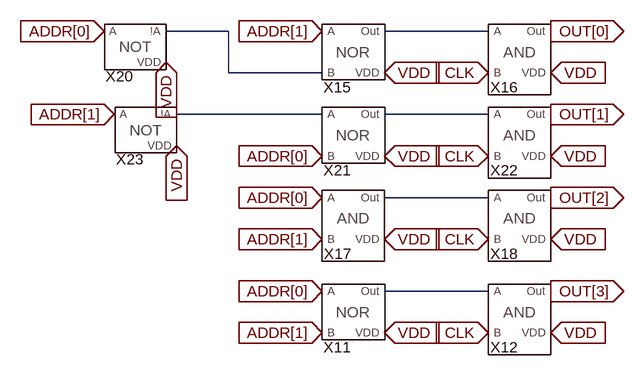
[diagram p0: schematic Decoder.asc]
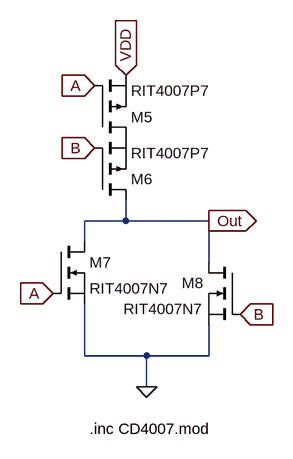
[diagram p1: sub-circuit gate_nor.asc]
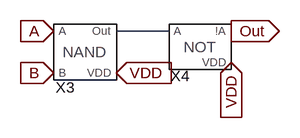
[diagram p2: sub-circuit gate_and.asc]
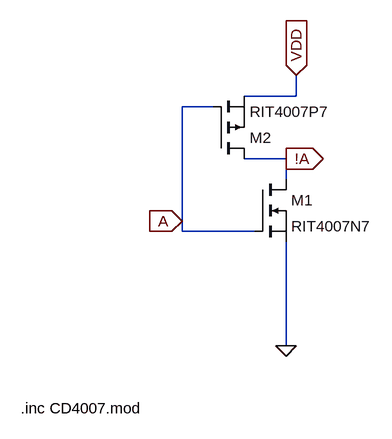
[diagram p3: sub-circuit gate_not.asc]
Decoder.asc, the LTspice schematic file:
Version 4
SHEET 1 1132 1208
WIRE -688 112 -784 112
WIRE -288 112 -448 112
WIRE -688 176 -688 112
WIRE -544 176 -688 176
WIRE -544 240 -768 240
WIRE -288 240 -448 240
WIRE -288 368 -448 368
WIRE -288 512 -448 512
FLAG -544 512 ADDR[0]
IOPIN -544 512 In
FLAG -544 576 ADDR[1]
IOPIN -544 576 In
FLAG -448 576 VDD
IOPIN -448 576 In
FLAG -288 576 CLK
IOPIN -288 576 In
FLAG -192 576 VDD
IOPIN -192 576 In
FLAG -544 112 ADDR[1]
IOPIN -544 112 In
FLAG -880 112 ADDR[0]
IOPIN -880 112 In
FLAG -784 160 VDD
IOPIN -784 160 In
FLAG -288 176 CLK
IOPIN -288 176 In
FLAG -192 176 VDD
IOPIN -192 176 In
FLAG -544 368 ADDR[0]
IOPIN -544 368 In
FLAG -544 432 ADDR[1]
IOPIN -544 432 In
FLAG -448 432 VDD
IOPIN -448 432 In
FLAG -288 432 CLK
IOPIN -288 432 In
FLAG -192 432 VDD
IOPIN -192 432 In
FLAG -864 240 ADDR[1]
IOPIN -864 240 In
FLAG -544 304 ADDR[0]
IOPIN -544 304 In
FLAG -768 288 VDD
IOPIN -768 288 In
FLAG -288 304 CLK
IOPIN -288 304 In
FLAG -192 304 VDD
IOPIN -192 304 In
FLAG -448 304 VDD
IOPIN -448 304 In
FLAG -448 176 VDD
IOPIN -448 176 In
FLAG -192 512 OUT[3]
IOPIN -192 512 Out
FLAG -192 112 OUT[0]
IOPIN -192 112 Out
FLAG -192 240 OUT[1]
IOPIN -192 240 Out
FLAG -192 368 OUT[2]
IOPIN -192 368 Out
SYMBOL Gate_NOR -496 544 R0
SYMATTR InstName X11
SYMBOL Gate_AND -240 544 R0
SYMATTR InstName X12
SYMBOL Gate_NOR -496 144 R0
SYMATTR InstName X15
SYMBOL Gate_AND -240 144 R0
SYMATTR InstName X16
SYMBOL Gate_AND -240 400 R0
SYMATTR InstName X18
SYMBOL Gate_AND -496 400 R0
SYMATTR InstName X17
SYMBOL Gate_NOT -832 144 R0
SYMATTR InstName X20
SYMBOL Gate_NOR -496 272 R0
SYMATTR InstName X21
SYMBOL Gate_AND -240 272 R0
SYMATTR InstName X22
SYMBOL Gate_NOT -816 272 R0
SYMATTR InstName X23

gate_nor.asc, the sub-circuit schematic file:
Version 4
SHEET 1 880 680
WIRE -656 -80 -656 -112
WIRE -656 -80 -720 -80
WIRE -528 -80 -656 -80
WIRE -720 -48 -720 -80
WIRE -528 -16 -528 -80
WIRE -720 128 -720 48
WIRE -624 128 -720 128
WIRE -528 128 -528 80
WIRE -528 128 -624 128
WIRE -624 176 -624 128
FLAG -656 -304 VDD
IOPIN -656 -304 In
FLAG -528 -80 Out
IOPIN -528 -80 Out
FLAG -704 -288 A
IOPIN -704 -288 In
FLAG -768 32 A
IOPIN -768 32 In
FLAG -480 64 B
IOPIN -480 64 In
FLAG -704 -192 B
IOPIN -704 -192 In
FLAG -624 176 0
SYMBOL pmos -704 -208 M180
SYMATTR InstName M5
SYMATTR Value RIT4007P7
SYMBOL pmos -704 -112 M180
SYMATTR InstName M6
SYMATTR Value RIT4007P7
SYMBOL nmos -768 -48 R0
SYMATTR InstName M7
SYMATTR Value RIT4007N7
SYMBOL nmos -480 -16 M0
SYMATTR InstName M8
SYMATTR Value RIT4007N7
TEXT -712 240 Left 2 !.inc CD4007.mod

gate_and.asc, the sub-circuit schematic file:
Version 4
SHEET 1 880 680
WIRE -144 0 -224 0
FLAG -224 64 VDD
IOPIN -224 64 In
FLAG -48 48 VDD
IOPIN -48 48 In
FLAG -320 64 B
IOPIN -320 64 In
FLAG -320 0 A
IOPIN -320 0 In
FLAG -48 0 Out
IOPIN -48 0 Out
SYMBOL Gate_NAND -272 32 R0
SYMATTR InstName X3
SYMBOL Gate_NOT -96 32 R0
SYMATTR InstName X4

gate_not.asc, the sub-circuit schematic file:
Version 4
SHEET 1 880 680
WIRE 64 -112 64 -144
WIRE 64 -112 -16 -112
WIRE -64 -96 -112 -96
WIRE 48 -16 -16 -16
WIRE 48 16 48 -16
WIRE -112 80 -112 -96
WIRE -112 96 -112 80
WIRE 0 96 -112 96
WIRE 48 272 48 112
FLAG 48 272 0
FLAG -112 80 A
IOPIN -112 80 In
FLAG 48 -16 !A
IOPIN 48 -16 Out
FLAG 64 -144 VDD
IOPIN 64 -144 In
SYMBOL nmos 0 16 R0
SYMATTR InstName M1
SYMATTR Value RIT4007N7
SYMBOL pmos -64 -16 M180
SYMATTR InstName M2
SYMATTR Value RIT4007P7
TEXT -360 368 Left 2 !.inc CD4007.mod

The netlist it stands for:
* Decoder.asc
XX11 ADDR[0] ADDR[1] N006 VDD gate_nor
XX12 N006 CLK OUT[3] VDD gate_and
XX15 ADDR[1] N001 N002 VDD gate_nor
XX16 N002 CLK OUT[0] VDD gate_and
XX18 N005 CLK OUT[2] VDD gate_and
XX17 ADDR[0] ADDR[1] N005 VDD gate_and
XX20 ADDR[0] VDD N001 gate_not
XX21 N003 ADDR[0] N004 VDD gate_nor
XX22 N004 CLK OUT[1] VDD gate_and
XX23 ADDR[1] VDD N003 gate_not

* block symbol definitions
.subckt gate_nor A B Out VDD
M5 P001 A VDD VDD RIT4007P7
M6 Out B P001 P001 RIT4007P7
M7 Out A 0 0 RIT4007N7
M8 Out B 0 0 RIT4007N7
.inc CD4007.mod
.ends gate_nor

.subckt gate_and A B Out VDD
XX3 A B N001 VDD Gate_NAND  ; pins A B Out VDD
XX4 N001 VDD Out gate_not
.ends gate_and

.subckt gate_not A VDD !A
M1 !A A 0 0 RIT4007N7
M2 !A A VDD VDD RIT4007P7
.inc CD4007.mod
.ends gate_not

.model NMOS NMOS
.model PMOS PMOS
.lib standard.mos
.backanno
.end